# Altium schematic sheet FMC_HPC_UFL_DEBUG_J85_J156.SchDoc: 72 U.FL connectors J85 .. J144 (12 x 6 array)
size A4; Date: 13.12.2024; ApprovedBy: PFH; CompanyName: IAM Electronic GmbH; DrawnBy: PFH; Engineer: PFH; DocumentNumber: 3; Revision: A; SheetNumber: 3; SheetTotal: 9; Projekt: FMC HPC-U.FL Debug Board; Website: www.fmchub.com
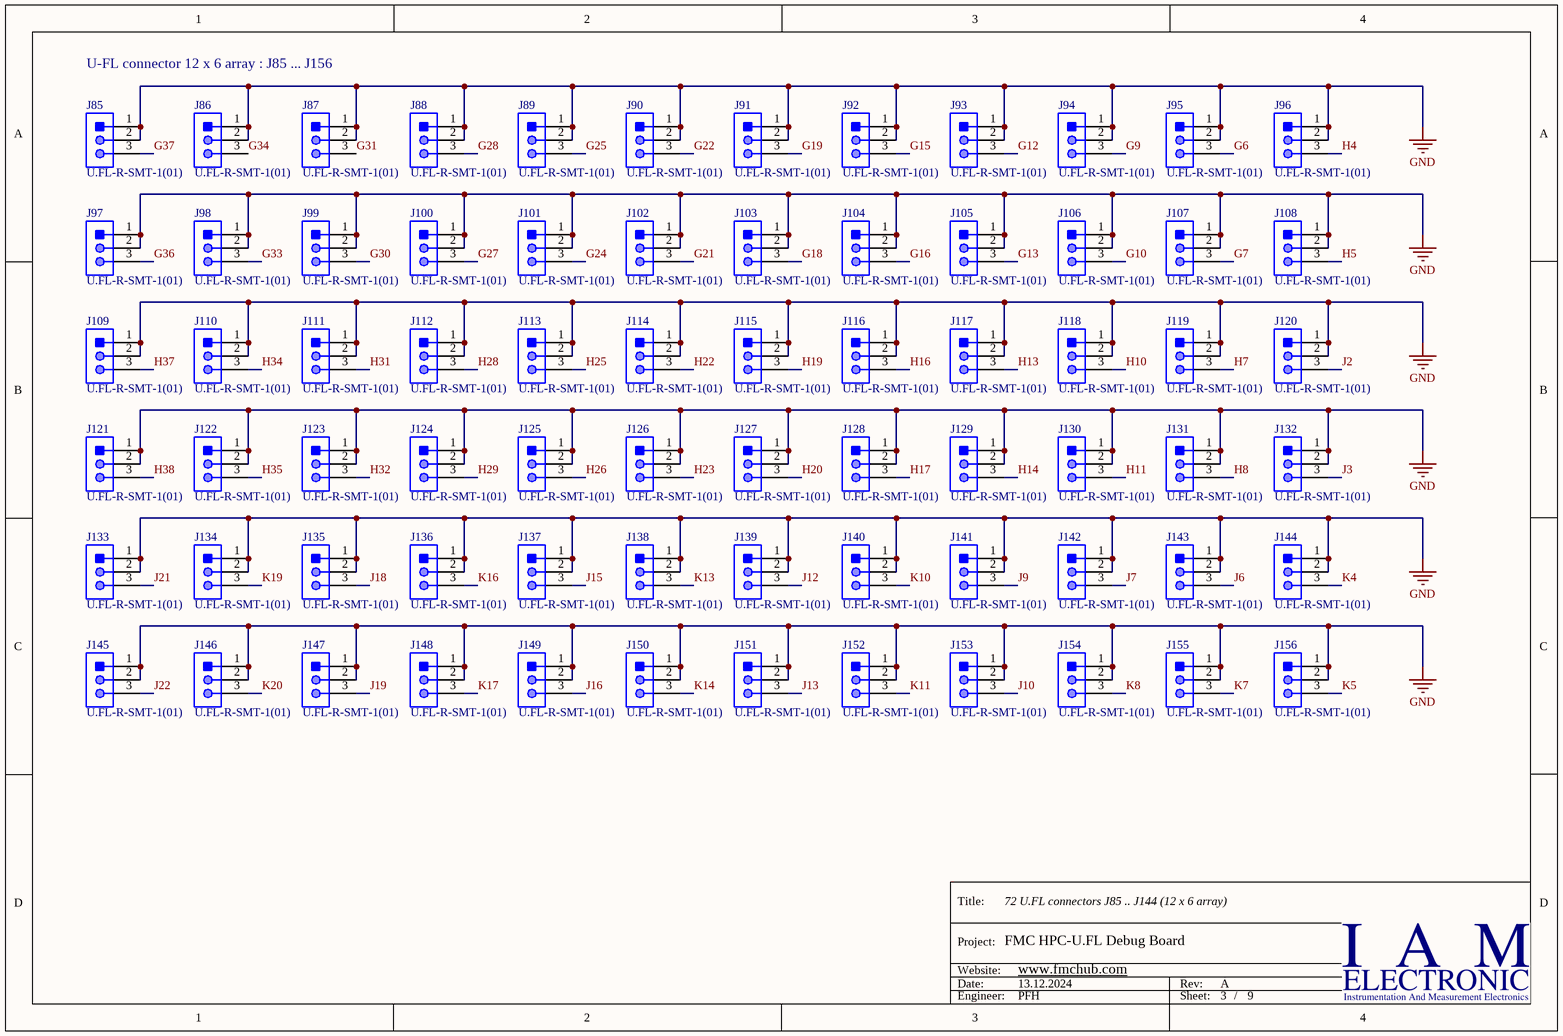
[diagram p0: FMC_HPC_UFL_DEBUG_J85_J156.SchDoc]

## Parts
J85  U.FL-R-SMT-1(01)  [HRS-U.FL-R-SMT-3_V]
J86  U.FL-R-SMT-1(01)  [HRS-U.FL-R-SMT-3_V]
J87  U.FL-R-SMT-1(01)  [HRS-U.FL-R-SMT-3_V]
J88  U.FL-R-SMT-1(01)  [HRS-U.FL-R-SMT-3_V]
J89  U.FL-R-SMT-1(01)  [HRS-U.FL-R-SMT-3_V]
J90  U.FL-R-SMT-1(01)  [HRS-U.FL-R-SMT-3_V]
J91  U.FL-R-SMT-1(01)  [HRS-U.FL-R-SMT-3_V]
J92  U.FL-R-SMT-1(01)  [HRS-U.FL-R-SMT-3_V]
J93  U.FL-R-SMT-1(01)  [HRS-U.FL-R-SMT-3_V]
J94  U.FL-R-SMT-1(01)  [HRS-U.FL-R-SMT-3_V]
J95  U.FL-R-SMT-1(01)  [HRS-U.FL-R-SMT-3_V]
J96  U.FL-R-SMT-1(01)  [HRS-U.FL-R-SMT-3_V]
J97  U.FL-R-SMT-1(01)  [HRS-U.FL-R-SMT-3_V]
J98  U.FL-R-SMT-1(01)  [HRS-U.FL-R-SMT-3_V]
J99  U.FL-R-SMT-1(01)  [HRS-U.FL-R-SMT-3_V]
J100  U.FL-R-SMT-1(01)  [HRS-U.FL-R-SMT-3_V]
J101  U.FL-R-SMT-1(01)  [HRS-U.FL-R-SMT-3_V]
J102  U.FL-R-SMT-1(01)  [HRS-U.FL-R-SMT-3_V]
J103  U.FL-R-SMT-1(01)  [HRS-U.FL-R-SMT-3_V]
J104  U.FL-R-SMT-1(01)  [HRS-U.FL-R-SMT-3_V]
J105  U.FL-R-SMT-1(01)  [HRS-U.FL-R-SMT-3_V]
J106  U.FL-R-SMT-1(01)  [HRS-U.FL-R-SMT-3_V]
J107  U.FL-R-SMT-1(01)  [HRS-U.FL-R-SMT-3_V]
J108  U.FL-R-SMT-1(01)  [HRS-U.FL-R-SMT-3_V]
J109  U.FL-R-SMT-1(01)  [HRS-U.FL-R-SMT-3_V]
J110  U.FL-R-SMT-1(01)  [HRS-U.FL-R-SMT-3_V]
J111  U.FL-R-SMT-1(01)  [HRS-U.FL-R-SMT-3_V]
J112  U.FL-R-SMT-1(01)  [HRS-U.FL-R-SMT-3_V]
J113  U.FL-R-SMT-1(01)  [HRS-U.FL-R-SMT-3_V]
J114  U.FL-R-SMT-1(01)  [HRS-U.FL-R-SMT-3_V]
J115  U.FL-R-SMT-1(01)  [HRS-U.FL-R-SMT-3_V]
J116  U.FL-R-SMT-1(01)  [HRS-U.FL-R-SMT-3_V]
J117  U.FL-R-SMT-1(01)  [HRS-U.FL-R-SMT-3_V]
J118  U.FL-R-SMT-1(01)  [HRS-U.FL-R-SMT-3_V]
J119  U.FL-R-SMT-1(01)  [HRS-U.FL-R-SMT-3_V]
J120  U.FL-R-SMT-1(01)  [HRS-U.FL-R-SMT-3_V]
J121  U.FL-R-SMT-1(01)  [HRS-U.FL-R-SMT-3_V]
J122  U.FL-R-SMT-1(01)  [HRS-U.FL-R-SMT-3_V]
J123  U.FL-R-SMT-1(01)  [HRS-U.FL-R-SMT-3_V]
J124  U.FL-R-SMT-1(01)  [HRS-U.FL-R-SMT-3_V]
J125  U.FL-R-SMT-1(01)  [HRS-U.FL-R-SMT-3_V]
J126  U.FL-R-SMT-1(01)  [HRS-U.FL-R-SMT-3_V]
J127  U.FL-R-SMT-1(01)  [HRS-U.FL-R-SMT-3_V]
J128  U.FL-R-SMT-1(01)  [HRS-U.FL-R-SMT-3_V]
J129  U.FL-R-SMT-1(01)  [HRS-U.FL-R-SMT-3_V]
J130  U.FL-R-SMT-1(01)  [HRS-U.FL-R-SMT-3_V]
J131  U.FL-R-SMT-1(01)  [HRS-U.FL-R-SMT-3_V]
J132  U.FL-R-SMT-1(01)  [HRS-U.FL-R-SMT-3_V]
J133  U.FL-R-SMT-1(01)  [HRS-U.FL-R-SMT-3_V]
J134  U.FL-R-SMT-1(01)  [HRS-U.FL-R-SMT-3_V]
J135  U.FL-R-SMT-1(01)  [HRS-U.FL-R-SMT-3_V]
J136  U.FL-R-SMT-1(01)  [HRS-U.FL-R-SMT-3_V]
J137  U.FL-R-SMT-1(01)  [HRS-U.FL-R-SMT-3_V]
J138  U.FL-R-SMT-1(01)  [HRS-U.FL-R-SMT-3_V]
J139  U.FL-R-SMT-1(01)  [HRS-U.FL-R-SMT-3_V]
J140  U.FL-R-SMT-1(01)  [HRS-U.FL-R-SMT-3_V]
J141  U.FL-R-SMT-1(01)  [HRS-U.FL-R-SMT-3_V]
J142  U.FL-R-SMT-1(01)  [HRS-U.FL-R-SMT-3_V]
J143  U.FL-R-SMT-1(01)  [HRS-U.FL-R-SMT-3_V]
J144  U.FL-R-SMT-1(01)  [HRS-U.FL-R-SMT-3_V]
J145  U.FL-R-SMT-1(01)  [HRS-U.FL-R-SMT-3_V]
J146  U.FL-R-SMT-1(01)  [HRS-U.FL-R-SMT-3_V]
J147  U.FL-R-SMT-1(01)  [HRS-U.FL-R-SMT-3_V]
J148  U.FL-R-SMT-1(01)  [HRS-U.FL-R-SMT-3_V]
J149  U.FL-R-SMT-1(01)  [HRS-U.FL-R-SMT-3_V]
J150  U.FL-R-SMT-1(01)  [HRS-U.FL-R-SMT-3_V]
J151  U.FL-R-SMT-1(01)  [HRS-U.FL-R-SMT-3_V]
J152  U.FL-R-SMT-1(01)  [HRS-U.FL-R-SMT-3_V]
J153  U.FL-R-SMT-1(01)  [HRS-U.FL-R-SMT-3_V]
J154  U.FL-R-SMT-1(01)  [HRS-U.FL-R-SMT-3_V]
J155  U.FL-R-SMT-1(01)  [HRS-U.FL-R-SMT-3_V]
J156  U.FL-R-SMT-1(01)  [HRS-U.FL-R-SMT-3_V]

## Nets
GND: J85.1 J85.2 J86.1 J86.2 J87.1 J87.2 J88.1 J88.2 J89.1 J89.2 J90.1 J90.2 J91.1 J91.2 J92.1 J92.2 J93.1 J93.2 J94.1 J94.2 J95.1 J95.2 J96.1 J96.2 J97.1 J97.2 J98.1 J98.2 J99.1 J99.2 J100.1 J100.2 J101.1 J101.2 J102.1 J102.2 J103.1 J103.2 J104.1 J104.2 J105.1 J105.2 J106.1 J106.2 J107.1 J107.2 J108.1 J108.2 J109.1 J109.2 J110.1 J110.2 J111.1 J111.2 J112.1 J112.2 J113.1 J113.2 J114.1 J114.2 J115.1 J115.2 J116.1 J116.2 J117.1 J117.2 J118.1 J118.2 J119.1 J119.2 J120.1 J120.2 J121.1 J121.2 J122.1 J122.2 J123.1 J123.2 J124.1 J124.2 J125.1 J125.2 J126.1 J126.2 J127.1 J127.2 J128.1 J128.2 J129.1 J129.2 J130.1 J130.2 J131.1 J131.2 J132.1 J132.2 J133.1 J133.2 J134.1 J134.2 J135.1 J135.2 J136.1 J136.2 J137.1 J137.2 J138.1 J138.2 J139.1 J139.2 J140.1 J140.2 J141.1 J141.2 J142.1 J142.2 J143.1 J143.2 J144.1 J144.2 J145.1 J145.2 J146.1 J146.2 J147.1 J147.2 J148.1 J148.2 J149.1 J149.2 J150.1 J150.2 J151.1 J151.2 J152.1 J152.2 J153.1 J153.2 J154.1 J154.2 J155.1 J155.2 J156.1 J156.2
G6: J95.3
G7: J107.3
G9: J94.3
G10: J106.3
G12: J93.3
G13: J105.3
G15: J92.3
G16: J104.3
G18: J103.3
G19: J91.3
G21: J102.3
G22: J90.3
G24: J101.3
G25: J89.3
G27: J100.3
G28: J88.3
G30: J99.3
G31: J87.3
G33: J98.3
G34: J86.3
G36: J97.3
G37: J85.3
H4: J96.3
H5: J108.3
H7: J119.3
H8: J131.3
H10: J118.3
H11: J130.3
H13: J117.3
H14: J129.3
H16: J116.3
H17: J128.3
H19: J115.3
H20: J127.3
H22: J114.3
H23: J126.3
H25: J113.3
H26: J125.3
H28: J112.3
H29: J124.3
H31: J111.3
H32: J123.3
H34: J110.3
H35: J122.3
H37: J109.3
H38: J121.3
J2: J120.3
J3: J132.3
J6: J143.3
J7: J142.3
J9: J141.3
J10: J153.3
J12: J139.3
J13: J151.3
J15: J137.3
J16: J149.3
J18: J135.3
J19: J147.3
J21: J133.3
J22: J145.3
K4: J144.3
K5: J156.3
K7: J155.3
K8: J154.3
K10: J140.3
K11: J152.3
K13: J138.3
K14: J150.3
K16: J136.3
K17: J148.3
K19: J134.3
K20: J146.3

## Notes on the sheet
- U-FL connector 12 x 6 array : J85 ... J156
- Title:
- Project:
- Date:
- Website:
- Rev:
- Engineer:
- Sheet:
- /

## Library data of the parts
J85-J156 = CMP-2000-05153-1: Ultra Small Coaxial Connector, 6 GHz, -40 to 90 degC, 3-Pin SMD, RoHS, Bulk; Manufacturer: Hirose Electric; Connector Style: U.FL; Impedance: 50Ohm; Dielectric Material: LiquidCrystalPolymer(LCP); Minimum Quantity: UltraMiniatureCoaxial; Online Catalog: U.FLSeries; Featured Product: HiroseU.FLSeries; Frequency - Max: 6GHz; Other Names: H122041 / U.FL-R-SMT-1(01)-ND; Contact Termination: Solder; Body Material: PhosphorBronze; Connector Type: Jack,MalePin; Body Finish: Silver; Center Contact Plating: Gold; Manufacturer URL: https://www.hirose.com; Family: CoaxialConnectors(RF); Fastening Type: Snap-On; Unit PriceUSD: U.FL; Series: U.FL; Package Reference: U.FL-R-SMT; Packaging: Bulk; Standard Package: 100; Mounting Type: SurfaceMount; Quantity Available: Bulk; Housing Color: Silver; Package Description: 3-Pin Surface Mount Device, Body 2.6 x 2.6 mm; Category: Connectors,Interconnects; Operating Temperature: -40degC~90degC; Center Contact Material: PhosphorBronze; Dynamic Catalog: U.FLSeries; Datasheet URL: https://datasheet.ciiva.com/26945/getdatasheetpartid-475239-26945414.pdf; Datasheet Version: Feb-09; Shield Termination: Solder; Part: U.FL-R-SMT-1(01); Part2: 331-0472-2 01